# Altium schematic sheet Sheet1.SchDoc
size A
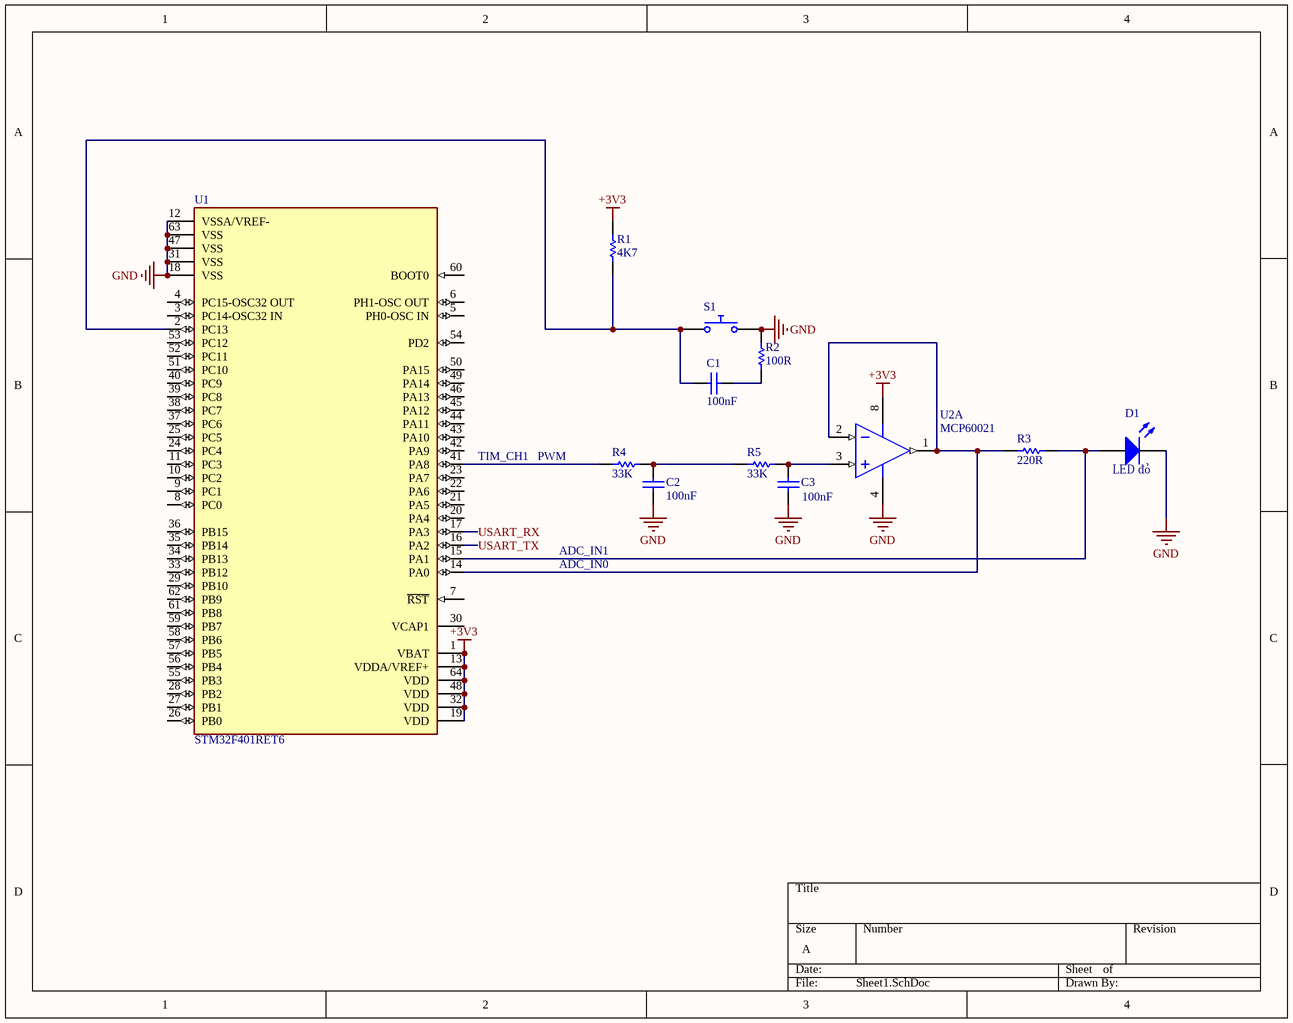
[diagram p0: Sheet1.SchDoc]

## Parts
C1  value 100nF  (hidden comment: Capacitor)
C2  value 100nF  (hidden comment: Capacitor)
C3  value 100nF  (hidden comment: Capacitor)
D1  Light-Emitting Diode  (value not drawn)
R1  value 4K7  (hidden comment: Resistor)
R2  value 100R  (hidden comment: Resistor)
R3  value 220R  (hidden comment: Resistor)
R4  value 33K  (hidden comment: Resistor)
R5  value 33K  (hidden comment: Resistor)
S1  Push Button Normally Opened  (value not drawn)
U1  STM32F401RET6  [FP-LQFP64-5W-MFG]
U2  MCP60021  [MSOP-MS8_L]  (part A of 2)

## Nets
+3V3: R1.2 U1.1(VBAT) U1.13(VDDA/VREF+) U1.19(VDD) U1.32(VDD) U1.48(VDD) U1.64(VDD) U2.8(VDD)
GND: C2.1 C3.1 D1.2(K) R2.2 S1.2 U1.12(VSSA/VREF-) U1.18(VSS) U1.31(VSS) U1.47(VSS) U1.63(VSS) U2.4(VSS)
USART_RX: U1.17(PA3)
USART_TX: U1.16(PA2)
NetC1_1: C1.1 R2.1
NetC1_2: C1.2 R1.1 S1.1 U1.2(PC13)
NetC2_2: C2.2 R4.2 R5.1
NetC3_2: C3.2 R5.2 U2.3(VINA+)
NetD1_1: D1.1(A) R3.2 U1.15(PA1)
NetR3_1: R3.1 U1.14(PA0) U2.1(VOUTA) U2.2(VINA-)
NetR4_1: R4.1 U1.41(PA8)

Not connected (* = marked no-connect by the designer): U1 3(PC14-OSC32_IN) 4(PC15-OSC32_OUT) 5(PH0-OSC_IN) 6(PH1-OSC_OUT) 7(~{RST}) 8(PC0) 9(PC1) 10(PC2) 11(PC3) 20(PA4) 21(PA5) 22(PA6) 23(PA7) 24(PC4) 25(PC5) 26(PB0) 27(PB1) 28(PB2) 29(PB10) 30(VCAP1) 33(PB12) 34(PB13) 35(PB14) 36(PB15) 37(PC6) 38(PC7) 39(PC8) 40(PC9) 42(PA9) 43(PA10) 44(PA11) 45(PA12) 46(PA13) 49(PA14) 50(PA15) 51(PC10) 52(PC11) 53(PC12) 54(PD2) 55(PB3) 56(PB4) 57(PB5) 58(PB6) 59(PB7) 60(BOOT0) 61(PB8) 62(PB9)

## Notes on the sheet
- TIM_CH1   PWM
- (near D1) LED đỏ
- ADC_IN0
- ADC_IN1

## Library data of the parts
C1-C3 = Capacitor: SimulationGenericComponent: True
D1 = LED: AF: 1; BV: 0; BV_MAX: 1e99; EG: 1.11; FC: 0.5; IBV: 0.001; IS: 1e-14; MJSW: 0.33; NTUN: 30; TNOM: 27; XTI: 3; SimulationGenericComponent: True; CJO: 0; CJP: 0; CTA: 0; CTP: 0; FCS: 0.5; FV_MAX: 1e99; IKF: 0; IKR: 0; ISR: 1e-14; JSW: 0; JTUN: 0; JTUNSW: 0; KEG: 1; KF: 0; LEVEL: 1; N: 1; NBV: 1; NR: 1; NS: 1; PHP: 1; RS: 0; TCV: 0; TLEV: 0; TLEVC: 0; TM1: 0; TM2: 0; TPB: 0; TPHP: 0; TRS: 0; TRS2: 0; TT: 0; TTT1: 0; TTT2: 0; VJ: 1; XTITUN: 3
R1-R5 = Resistor: TC1: 0; SimulationGenericComponent: True; TC2: 0
S1 = Push Button NO: closed: 0; Rclosed: 1m; Ropen: 1Meg; SimulationGenericComponent: True
U1 = CMP-12105-000004-1: IC MCU 32BIT 512KB FLASH 64LQFP; Manufacturer: STMicroelectronics; Memory Size: 512KBytes; Number Of Cores: 1; Max Junction Temp: +105°C; Ram Size: 96KBytes; Number Of Adc Channels: 12; Number Of Pwm Channels: 23; Standoff Height: 0.05mm; Frequency: 84MHz; Number Of Timers/Counters: 8; Number Of I/Os: 50; Interface: I2C,SPI,USART,USB,IrDA,I2S,SMBus,Other; Number Of I2C Channels: 3; Max Supply Voltage: 3.6V; Data Bus Width: 32bits; Core Architecture: ARM Cortex-M4; Min Supply Voltage: 1.65V; Category: IC; Device Class L3: Microcontrollers; ComponentLink2URL: https://www.st.com/resource/en/datasheet/stm32f401re.pdf; RoHS: TRUE; Temperature Range High: +105°C; Device Class L2: Embedded Processors and Controllers; ComponentLink2Description: Datasheet; Temperature Range Low: -40°C; Digikey Description: IC MCU 32BIT 512KB FLASH 64LQFP; Package: LQFP64-5W; Manufacturer Part Number: STM32F401RET6; Number Of A/D Converters: 1; Ipc Land Pattern Name: QFP50P1200X1200X160-64; Automotive: No; Ambient Temperature Range Low: -40°C; Height: 1.6mm; Octopart: https://octopart.com/stm32f401ret6-stmicroelectronics-34185993; Ambient Temperature Range High: +85°C; Device Class L1: Integrated Circuits (ICs); Temperature: -40°C to +105°C; Number Of Spi Channels: 3; Number Of Uart Channels: 3; Memory Type: FLASH; Number Of Usb Channels: 1; Lead Free: Yes; Mouser Description: ARM Microcontrollers - MCU 16/32-BITS MICROS
U2 = CMP-0187-00058-3: None; Supply Current: 100uA; Number of Amplifiers: 2; Max Frequency: 1kHz; Slew Rate: 0.6V/µs; Power Supply Rejection Ratio (PSRR): 86dB; Input Offset Voltage-Max: 4.5mV; Min Supply Voltage: 1.8V; Common Mode Rejection Ratio: 60dB; Max Supply Voltage: 6V; Bandwidth: 1MHz; Input Bias Current: 1pA; Voltage Gain: 112dB; Operating Supply Voltage: 5.5V; Amplifier Type: GENERAL PURPOSE; Output Current: 23mA; Technology: CMOS; Number of Elements: 2; REACH SVHC: No SVHC; Number of Channels: 2; Input Offset Voltage (Vos): 4.5mV; Height: 0.037inch; Nominal Supply Current: 100uA; Lead Free: Lead Free; Min Operating Temperature: -40°C; Case/Package: MSOP; Packaging: Tape and Reel; Package Quantity: 2500; Max Operating Temperature: 85°C; Unity Gain Bandwidth Product: 1MHz; Mount: Surface Mount; Length: 0.118inch; Slew Rate-Nom: 0.6V/µs; Width: 0.118inch; Number of Circuits: 2; Number of Pins: 8; RoHS Compliant: Yes; Gain Bandwidth Product: 1MHz; Radiation Hardening: No